# EAGLE design PST-10 (EAGLE 8.5.0)

## Sheet 1 of 2
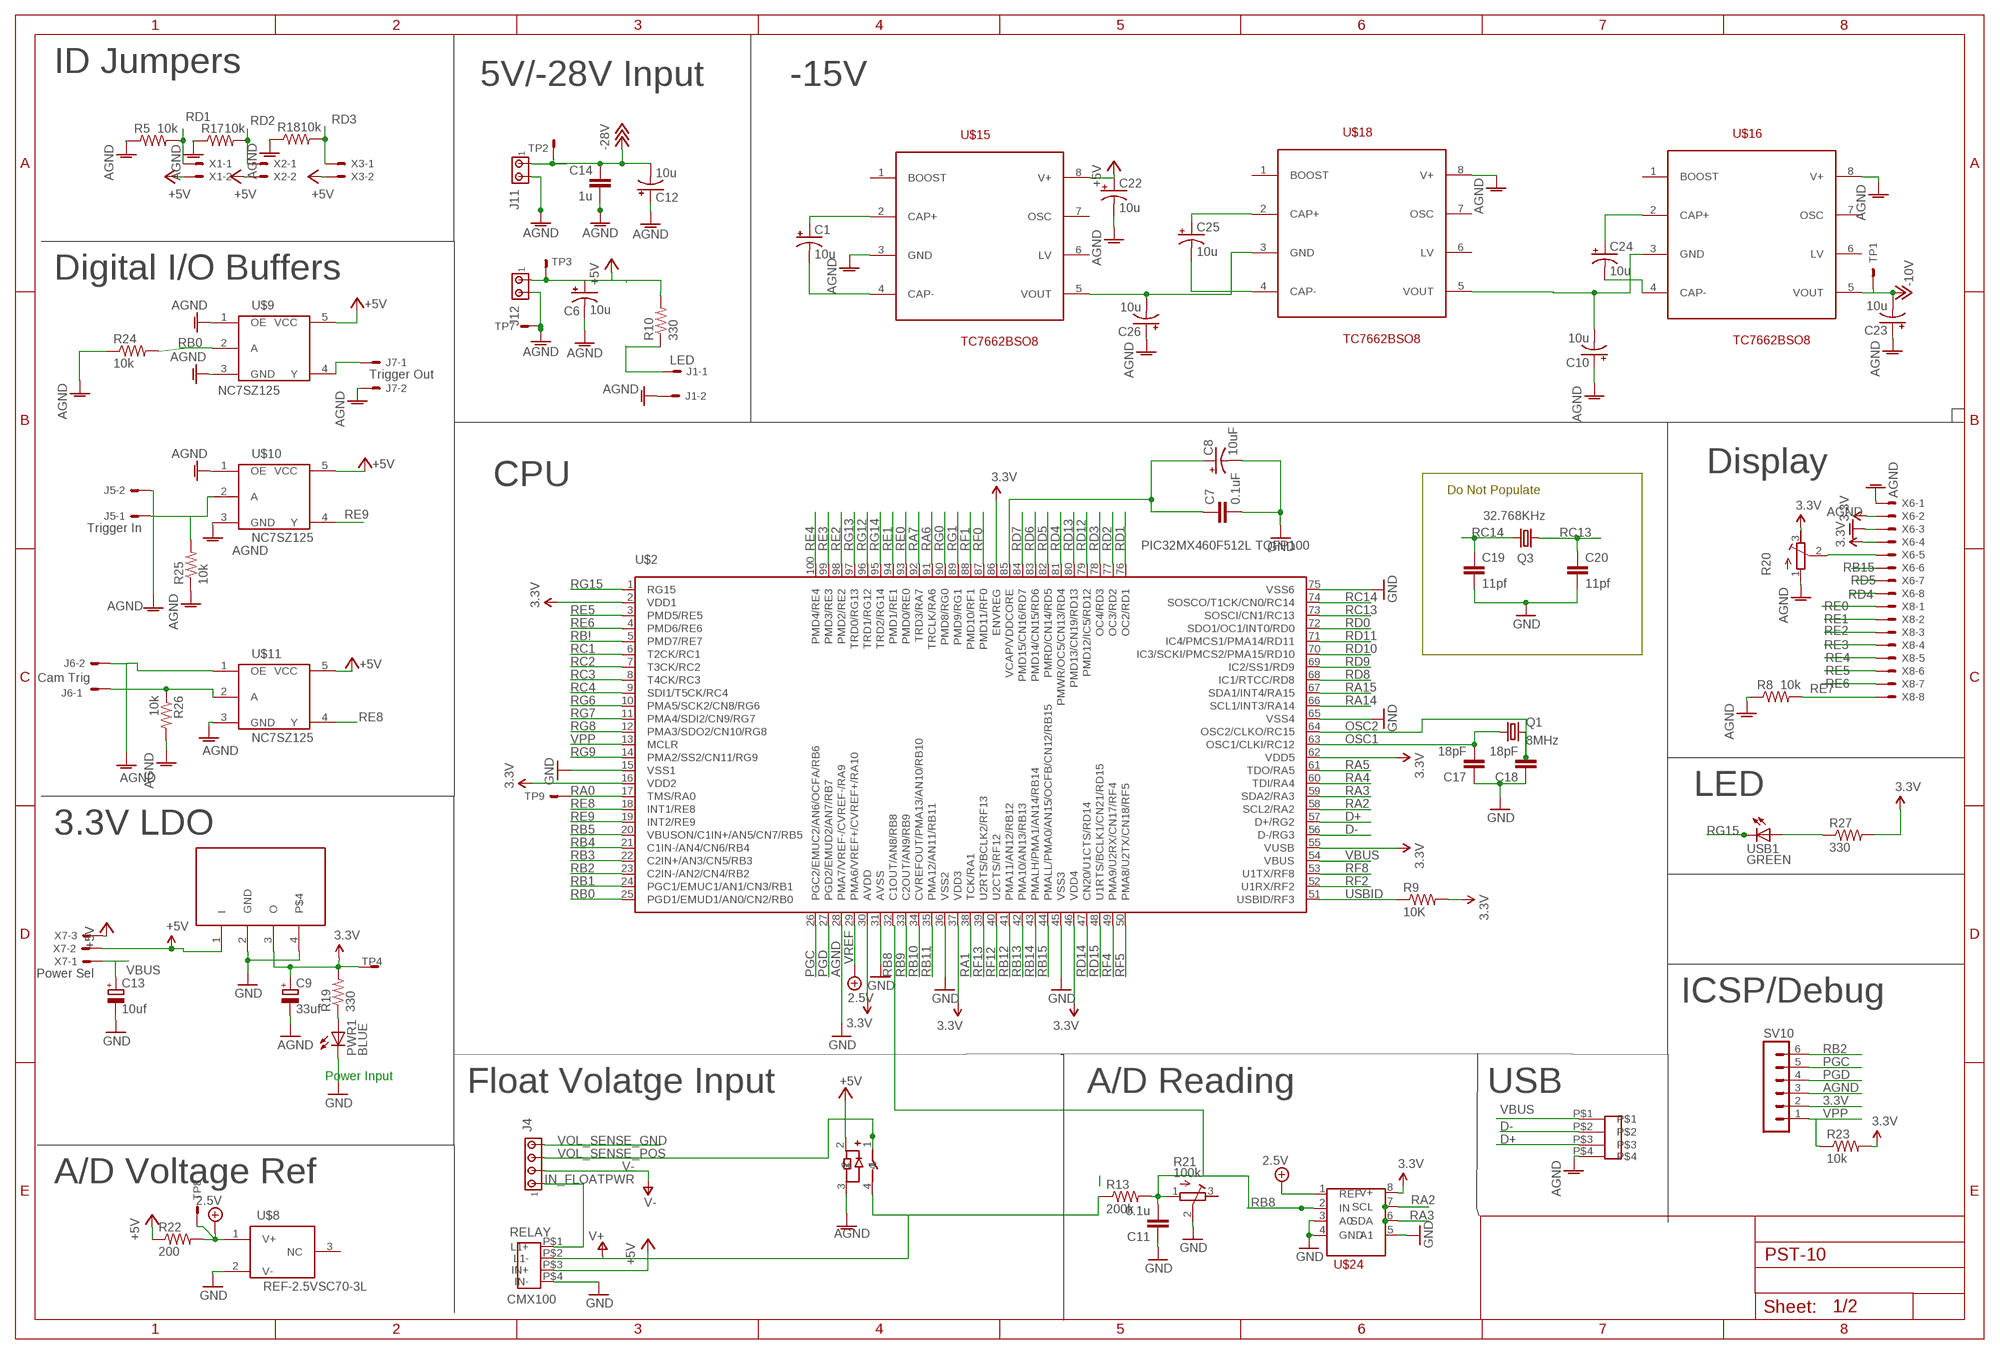
[diagram p0: schematic, sheet 1]

### Parts
C1  10u  CPOL-USE2-4  [E2-4]
C6  10u  CPOL-USE2-4  [E2-4]
C7  0.1uF  CAP0402-CAP  [0402-CAP]
C8  10uF  CAP_POL3528  [EIA3528]
C9  33uf  CPOL-EUE5-4  [E5-4]
C10  10u  CPOL-USE2-4  [E2-4]
C11  0.1u  C-EUC1206  [C1206]
C12  10u  CPOL-USE2-4  [E2-4]
C13  10uf  CPOL-EUE5-4  [E5-4]
C14  1u  C-EU025-024X044  [C025-024X044]
C17  18pF  CAP0402-CAP  [0402-CAP]
C18  18pF  CAP0402-CAP  [0402-CAP]
C19  11pf  CAP0402-CAP  [0402-CAP]
C20  11pf  CAP0402-CAP  [0402-CAP]
C22  10u  CPOL-USE2-4  [E2-4]
C23  10u  CPOL-USE2-4  [E2-4]
C24  10u  CPOL-USE2-4  [E2-4]
C25  10u  CPOL-USE2-4  [E2-4]
C26  10u  CPOL-USE2-4  [E2-4]
J1  LED  22-27-2021-02  [6410-02]
J4  MTA04-156  [1X4MTA]
J5  Trigger In  22-27-2021-02  [6410-02]
J6  Cam Trig  22-27-2021-02  [6410-02]
J7  Trigger Out  22-27-2021-02  [6410-02]
J11  MTA02-156  [1X2MTA]
J12  MTA02-156  [1X2MTA]
PWR1  BLUE  LED0603  [LED-0603]
Q1  8MHz  CRYSTAL5X3  [CRYSTAL-SMD-5X3]
Q3  32.768KHz  CRYSTAL32-SMD  [CRYSTAL-32KHZ-SMD]
R5  10k  R-US_R1206  [R1206]
R8  10k  R-US_R1206  [R1206]
R9  10K  RESISTOR0402-RES  [0402-RES]
R10  330  RESISTOR0402-RES  [0402-RES]
R13  200k  R-US_R1206  [R1206]
R17  10k  R-US_R1206  [R1206]
R18  10k  R-US_R1206  [R1206]
R19  330  RESISTOR0402-RES  [0402-RES]
R20  R-TRIMM3296W  [RTRIM3296W]
R21  100k  R-TRIMM3296W  [RTRIM3296W]
R22  200  R-US_R1206  [R1206]
R23  10k  R-US_R1206  [R1206]
R24  10k  R-US_R1206  [R1206]
R25  10k  R-US_R1206  [R1206]
R26  10k  R-US_R1206  [R1206]
R27  330  RESISTOR0402-RES  [0402-RES]
RELAY  CMX100  [CMX100D10]
SV10  MA06-1  [MA06-1]
TP1  TESTPOINT  [TESTPOINT]
TP2  TESTPOINT  [TESTPOINT]
TP3  TESTPOINT  [TESTPOINT]
TP4  TESTPOINT  [TESTPOINT]
TP7  TESTPOINT  [TESTPOINT]
TP8  TESTPOINT  [TESTPOINT]
TP9  TESTPOINT  [TESTPOINT]
U$2  PIC32MX460F512L TQFP100  PIC32MX4XXLTQFP100  [TQFP100]
U$7  3.3VREG  [SOT223]
U$8  REF-2.5VSC70-3L  [SC70-3L]
U$9  NC7SZ125  NC7SZ125SC70-5  [SC70-5]
U$10  NC7SZ125  NC7SZ125SC70-5  [SC70-5]
U$11  NC7SZ125  NC7SZ125SC70-5  [SC70-5]
U$15  TC7662BSO8  [SO8]
U$16  TC7662BSO8  [SO8]
U$18  TC7662BSO8  [SO8]
U$22  9007-05-01  [9007-05-01]
U$24  ADS7823MOSOP-08  [MSOP08]
USB  USB-B1KSW6  [USBB1K-4-VER]
USB1  GREEN  LED0603  [LED-0603]
X1  22-23-2021  [22-23-2021]
X2  22-23-2021  [22-23-2021]
X3  22-23-2021  [22-23-2021]
X6  22-23-2081  [22-23-2081]
X7  Power Sel  22-23-2031  [22-23-2031]
X8  22-23-2081  [22-23-2081]

### Nets
3.3V: C9.+ R9.2 R19.2 R20.3(A) R23.2 R27.2 SV10.2 TP4.TP(S) U$2.2(VDD1) U$2.16(VDD2) U$2.30(AVDD) U$2.37(VDD3) U$2.46(VDD4) U$2.55(VUSB) U$2.62(VDD5) U$2.86(ENVREG) U$7.3(O) U$24.8(V+) X6.2 X6.4
5V: U$7.1(I) X7.2 ; supply symbol labelled +5V
+5V: C6.+ C22.+ J12.1 R10.2 R22.1 RELAY.P$3(IN+) TP3.TP(S) U$9.5(VCC) U$10.5(VCC) U$11.5(VCC) U$15.8(V+) U$22.2 X1.2 X2.2 X3.2 X7.3 ; also sheet 2
-10V: C23.- TP1.TP(S) U$16.5(VOUT) ; also sheet 2
-18V: C12.- C14.1 J11.1 TP2.TP(S) ; supply symbol labelled -28V ; also sheet 2
AGND: C6.- C7.2 C8.C(-) C9.- C10.+ C11.1 C12.+ C13.- C14.2 C17.1 C18.1 C19.2 C20.2 C22.- C23.+ C26.+ J1.2 J5.2 J6.2 J7.2 J11.2 J12.2 PWR1.C R5.1 R8.1 R17.1 R18.1 R20.1(E) R21.2(S) R24.1 R25.1 R26.2 RELAY.P$4(IN-) SV10.3 TP7.TP(S) U$2.15(VSS1) U$2.28(PMA7/VREF-/CVREF-/RA9) U$2.31(AVSS) U$2.36(VSS2) U$2.45(VSS3) U$2.65(VSS4) U$2.75(VSS6) U$7.2(GND) U$7.4 U$8.2(V-) U$9.1(OE) U$9.3(GND) U$10.1(OE) U$10.3(GND) U$11.1(OE) U$11.3(GND) U$15.3(GND) U$16.8(V+) U$18.8(V+) U$22.3 U$24.3(A0) U$24.4(GND) U$24.5(A1) USB.P$4 X6.1 X6.3 ; supply symbol labelled GND ; also sheet 2
D+: U$2.57(D+/RG2) USB.P$3
D-: U$2.56(D-/RG3) USB.P$2
IN_FLOATPWR: J4.1 RELAY.P$1(L1+)
N$4: J6.1 R26.1 U$11.2(A)
N$6: R20.2(S) X6.5
N$10: C1.+ U$15.2(CAP+)
N$11: J1.1 R10.1
N$15: PWR1.A R19.1
N$16: J7.1 U$9.4(Y)
N$17: C1.- U$15.4(CAP-)
N$18: J5.1 R25.2 U$10.2(A)
N$22: C25.+ U$18.2(CAP+)
N$23: C10.- U$16.3(GND) U$18.5(VOUT)
N$25: C25.- U$18.4(CAP-)
N$26: C24.+ U$16.2(CAP+)
N$27: R27.1 USB1.A
N$28: C24.- U$16.4(CAP-)
N$33: C26.- U$15.5(VOUT) U$18.3(GND)
N$110: C7.1 C8.A(+) U$2.85(VCAP/VDDCORE)
OSC1: C17.2 Q1.1 U$2.63(OSC1/CLKI/RC12)
OSC2: C18.2 Q1.3 U$2.64(OSC2/CLKO/RC15)
PGC: SV10.5 U$2.26(PGC2/EMUC2/AN6/OCFA/RB6)
PGD: SV10.4 U$2.27(PGD2/EMUD2/AN7/RB7)
RA0: TP9.TP(S) U$2.17(TMS/RA0)
RA1: U$2.38(TCK/RA1)
RA2: U$2.58(SCL2/RA2) U$24.7(SCL)
RA3: U$2.59(SDA2/RA3) U$24.6(SDA)
RA4: U$2.60(TDI/RA4)
RA5: U$2.61(TDO/RA5)
RA6: U$2.91(TRCLK/RA6)
RA7: U$2.92(TRD3/RA7)
RA14: U$2.66(SCL1/INT3/RA14)
RA15: U$2.67(SDA1/INT4/RA15)
RB0: R24.2 U$2.25(PGD1/EMUD1/AN0/CN2/RB0) U$9.2(A)
RB1: U$2.24(PGC1/EMUC1/AN1/CN3/RB1)
RB2: SV10.6 U$2.23(C2IN-/AN2/CN4/RB2)
RB3: U$2.22(C2IN+/AN3/CN5/RB3)
RB4: U$2.21(C1IN-/AN4/CN6/RB4)
RB5: U$2.20(VBUSON/C1IN+/AN5/CN7/RB5)
RB8: C11.2 R13.2 R21.1(E) U$2.32(C1OUT/AN8/RB8) U$24.2(IN)
RB9: U$2.33(C2OUT/AN9/RB9)
RB10: U$2.34(CVREFOUT/PMA13/AN10/RB10)
RB11: U$2.35(PMA12/AN11/RB11)
RB12: U$2.41(PMA11/AN12/RB12)
RB13: U$2.42(PMA10/AN13/RB13)
RB14: U$2.43(PMALH/PMA1/AN14/RB14)
RB15: U$2.44(PMALL/PMA0/AN15/OCFB/CN12/RB15) X6.6
RB!: U$2.5(PMD7/RE7)
RC1: U$2.6(T2CK/RC1) ; also sheet 2
RC2: U$2.7(T3CK/RC2)
RC3: U$2.8(T4CK/RC3)
RC4: U$2.9(SDI1/T5CK/RC4)
RC13: C20.1 Q3.X1 U$2.73(SOSCI/CN1/RC13)
RC14: C19.1 Q3.X2 U$2.74(SOSCO/T1CK/CN0/RC14)
RD0: U$2.72(SDO1/OC1/INT0/RD0)
RD1: R5.2 U$2.76(OC2/RD1) X1.1
RD2: R17.2 U$2.77(OC3/RD2) X2.1
RD3: R18.2 U$2.78(OC4/RD3) X3.1
RD4: U$2.81(PMWR/OC5/CN13/RD4) X6.8
RD5: U$2.82(PMRD/CN14/RD5) X6.7
RD6: U$2.83(PMD14/CN15/RD6)
RD7: U$2.84(PMD15/CN16/RD7)
RD8: U$2.68(IC1/RTCC/RD8)
RD9: U$2.69(IC2/SS1/RD9)
RD10: U$2.70(IC3/SCKI/PMCS2/PMA15/RD10)
RD11: U$2.71(IC4/PMCS1/PMA14/RD11)
RD12: U$2.79(PMD12/IC5/RD12)
RD13: U$2.80(PMD13/CN19/RD13)
RD14: U$2.47(CN20/U1CTS/RD14)
RD15: U$2.48(U1RTS/BCLK1/CN21/RD15)
RE0: U$2.93(PMD0/RE0) X8.1
RE1: U$2.94(PMD1/RE1) X8.2
RE2: U$2.98(PMD2/RE2) X8.3
RE3: U$2.99(PMD3/RE3) X8.4
RE4: U$2.100(PMD4/RE4) X8.5
RE5: U$2.3(PMD5/RE5) X8.6
RE6: U$2.4(PMD6/RE6) X8.7
RE7: R8.2 X8.8
RE8: U$2.18(INT1/RE8) U$11.4(Y)
RE9: U$2.19(INT2/RE9) U$10.4(Y)
RF0: U$2.87(PMD11/RF0)
RF1: U$2.88(PMD10/RF1)
RF2: U$2.52(U1RX/RF2)
RF4: U$2.49(PMA9/U2RX/CN17/RF4)
RF5: U$2.50(PMA8/U2TX/CN18/RF5)
RF8: U$2.53(U1TX/RF8)
RF12: U$2.40(U2CTS/RF12)
RF13: U$2.39(U2RTS/BCLK2/RF13)
RG0: U$2.90(PMD8/RG0)
RG1: U$2.89(PMD9/RG1)
RG6: U$2.10(PMA5/SCK2/CN8/RG6)
RG7: U$2.11(PMA4/SDI2/CN9/RG7)
RG8: U$2.12(PMA3/SDO2/CN10/RG8)
RG9: U$2.14(PMA2/SS2/CN11/RG9)
RG12: U$2.96(TRD1/RG12)
RG13: U$2.97(TRD0/RG13)
RG14: U$2.95(TRD2/RG14)
RG15: U$2.1(RG15) USB1.C
USBID: R9.1 U$2.51(USBID/RF3)
V+: R13.1 RELAY.P$2(L1-) U$22.4 ; also sheet 2
V-: J4.2 ; also sheet 2
VBUS: C13.+ U$2.54(VBUS) USB.P$1 X7.1
VOL_SENSE_GND: J4.4 ; also sheet 2
VOL_SENSE_POS: J4.3 U$22.1
VPP: R23.1 SV10.1 U$2.13(MCLR)
VREF: R22.2 TP8.TP(S) U$2.29(PMA6/VREF+/CVREF+/RA10) U$8.1(V+) U$24.1(REF) ; supply symbol labelled 2.5V
Unconnected: R21.3(A) U$8.3(NC) U$15.1(BOOST) U$15.6(LV) U$15.7(OSC) U$16.1(BOOST) U$16.6(LV) U$16.7(OSC) U$18.1(BOOST) U$18.6(LV) U$18.7(OSC)

### Notes on the sheet
- ID Jumpers
- 5V/-28V Input | -15V
- Digital I/O Buffers
- Display
- CPU
- Do Not Populate
- LED
- 3.3V LDO
- ICSP/Debug
- Power Input
- Float Volatge Input | A/D Reading | USB
- A/D Voltage Ref

## Sheet 2 of 2
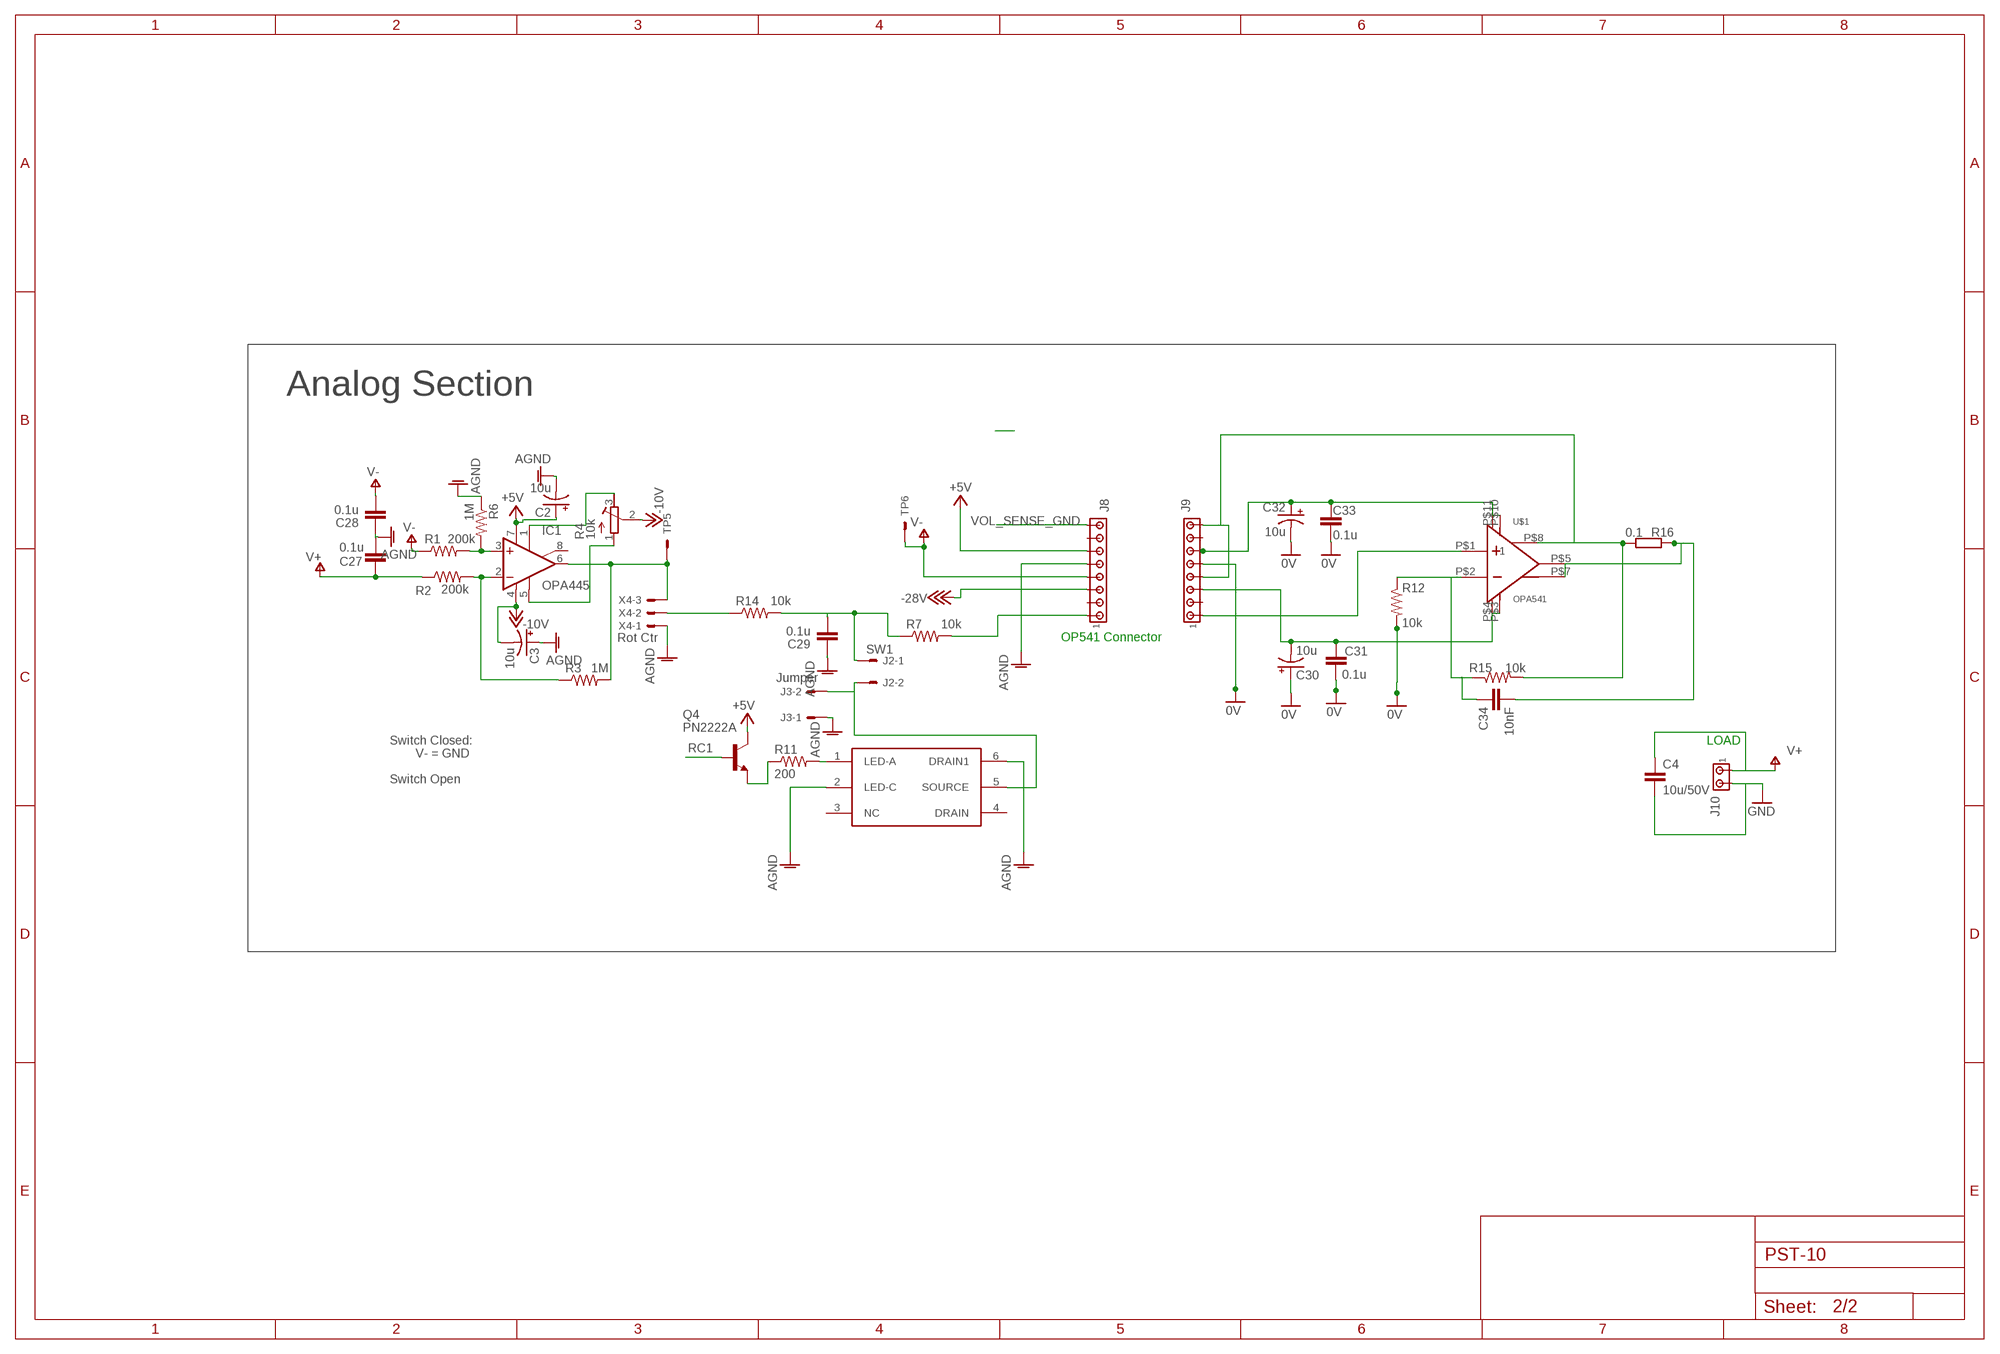
[diagram p1: schematic, sheet 2]

### Parts
C2  10u  CPOL-USE2-4  [E2-4]
C3  10u  CPOL-USE2-4  [E2-4]
C4  10u/50V  C-EUC1206  [C1206]
C27  0.1u  C-EUC1206  [C1206]
C28  0.1u  C-EUC1206  [C1206]
C29  0.1u  C-EUC1206  [C1206]
C30  10u  CPOL-USE2-4  [E2-4]
C31  0.1u  C-EU025-024X044  [C025-024X044]
C32  10u  CPOL-USE2-4  [E2-4]
C33  0.1u  C-EU025-024X044  [C025-024X044]
C34  10nF  C-EUC1206  [C1206]
IC1  OPA445  OP27Z  [DIL08]
J2  SW1  22-27-2021-02  [6410-02]
J3  Jumper  22-27-2021-02  [6410-02]
J8  MTA08-156  [1X8MTA]
J9  MTA08-156  [1X8MTA]
J10  MTA02-156  [1X2MTA]
Q4  PN2222A  [TO92-]
R1  200k  R-US_R1206  [R1206]
R2  200k  R-US_R1206  [R1206]
R3  1M  R-US_R1206  [R1206]
R4  10k  R-TRIMM3296W  [RTRIM3296W]
R6  1M  R-US_R1206  [R1206]
R7  10k  R-US_R1206  [R1206]
R11  200  R-US_R1206  [R1206]
R12  10k  R-US_R1206  [R1206]
R14  10k  R-US_R1206  [R1206]
R15  10k  R-US_R1206  [R1206]
R16  0.1  R-EU_V235/17  [V235/17]
TP5  TESTPOINT  [TESTPOINT]
TP6  TESTPOINT  [TESTPOINT]
U$1  OPA541  [OPA541]
U$4  PS7113DIL06  [DIL06]
X4  Rot Ctr  22-23-2031  [22-23-2031]

### Nets
0V: C30.+ C31.2 C32.- C33.1 J9.5 R12.2
+5V: C2.+ IC1.7(V+) J8.6 Q4.3(C) ; also sheet 1
-10V: C3.- IC1.4(V-) R4.2(S) ; also sheet 1
-18V: J8.3 ; supply symbol labelled -28V ; also sheet 1
AGND: C2.- C3.+ C4.2 C27.2 C28.1 C29.1 J3.1 J8.5 J10.2 R6.1 U$4.2(LED-C) U$4.6(DRAIN1) X4.1 ; supply symbol labelled GND ; also sheet 1
N$1: IC1.3(+IN) R1.2 R6.2
N$2: IC1.1(ON1) R4.3(A)
N$3: J8.1 R7.2
N$5: J9.4 J9.8 R15.2 R16.1 U$1.P$8(CURRENT_SENSE)
N$7: IC1.6(OUT) R3.2 TP5.TP(S) X4.3
N$8: IC1.2(-IN) R2.2 R3.1
N$9: R14.1 X4.2
N$12: J2.2 J3.2 U$4.5(SOURCE)
N$20: R11.2 U$4.1(LED-A)
N$21: Q4.1(E) R11.1
N$29: C29.2 J2.1 R7.1 R14.2
N$30: C30.- C31.1 J9.3 U$1.P$3(-VS) U$1.P$4(-VS2)
N$35: IC1.5(OPT) R4.1(E)
N$36: C32.+ C33.2 J9.6 U$1.P$10(V+) U$1.P$11(+VS2)
N$37: J9.1 U$1.P$1
N$38: C34.2 R16.2 U$1.P$5(VOUT) U$1.P$7(VOUT_2)
N$39: C34.1 R12.1 R15.1 U$1.P$2(IN-)
RC1: Q4.2(B) ; also sheet 1
V+: C4.1 C27.1 J10.1 R2.1 ; also sheet 1
V-: C28.2 J8.4 R1.1 TP6.TP(S) ; also sheet 1
VOL_SENSE_GND: J8.8 ; also sheet 1
Unconnected: IC1.8(ON2) J8.2 J8.7 J9.2 J9.7 U$4.3(NC) U$4.4(DRAIN)

### Notes on the sheet
- Analog Section
- OP541 Connector
- Switch Closed: | LOAD
- V- = GND
- Switch Open

## Library data of the parts
C1-C3 C6 C10 C12 C22-C26 C30 C32 = resistor:CPOL-US: POLARIZED CAPACITOR, American symbol
C4 C11 C14 C27-C29 C31 C33 C34 = rcl:C-EU: CAPACITOR, European symbol
C7 C17-C20 = SparkFun:CAP: Capacitor Standard 0603 ceramic capacitor, and 0.1" leaded capacitor.
C8 = SparkFun02-20-08:CAP_POL: Capacitor Polarized These are standard SMD and PTH capacitors. Normally 10uF, 47uF, and 100uF in electrolytic and tantalum varieties. Always verify the external diameter of the through hole cap, it varies with capacity, voltage, and manufacturer. The EIA devices should be standard.
C9 C13 = resistor:CPOL-EU: POLARIZED CAPACITOR, European symbol
IC1 = linear:OP27: OP AMP
J1-J3 J5-J7 = con-molex:22-?-02: CONNECTOR wire to board 2.54 mm (.1 inch) pitch header
J4 = con-amp:MTA04-156: AMP connector
J8 J9 = con-amp:MTA08-156: AMP connector
J10-J12 = con-amp:MTA02-156: AMP connector
PWR1 USB1 = SparkFun:LED: LEDs Standard schematic elements and footprints for 5mm, 3mm, 1206, and 0603 sized LEDs. 5mm - Spark Fun Electronics SKU : COM-00529 (and others)
Q1 = SparkFun11_03_09:CRYSTAL: Crystals Various standard crystals. Proven footprints. Spark Fun Electronics SKU : COM-00534
Q3 = SchmalzHaus:CRYSTAL: Crystals Various standard crystals. Proven footprints. Spark Fun Electronics SKU : COM-00534
Q4 = OMX-PICA:PN2222A: NPN Transistor
R1-R3 R5-R8 R11-R15 R17 R18 R22-R26 = resistor:R-US_: RESISTOR, American symbol
R4 R20 R21 = rcl:R-TRIMM: Trimm resistor
R9 R10 R19 R27 = SparkFun:RESISTOR: Resistor Basic schematic elements and footprints for 0603, 1206, and PTH 1/10th watt (small) resistors.
R16 = rcl:R-EU_: RESISTOR, European symbol
RELAY = OMX-MIX:CMX100
SV10 = con-lstb:MA06-1: PIN HEADER
TP1-TP9 = OMX-MIX:TESTPOINT
U$1 = Anthony-Relay:OPA541
U$2 = SchmalzHaus:PIC32MX4XXL
U$4 = OMX-MIX:PS7113
U$7 = SparkFun:3.3VREG
U$8 = OMX-MIX:REF-2.5V
U$9-U$11 = OMX-MIX:NC7SZ125
U$15 U$16 U$18 = OMX-MIX:TC7662B
U$22 = OMX-MIX:9007-05-01
U$24 = OMX-MIX:ADS7823
USB = OMX-MIX:USB-B1KSW6
X1-X3 = con-molex:22-23-2021: .100" (2.54mm) Center Header - 2 Pin
X4 X7 = con-molex:22-23-2031: .100" (2.54mm) Center Header - 3 Pin
X6 X8 = con-molex:22-23-2081: .100" (2.54mm) Center Header - 8 Pin

## Board
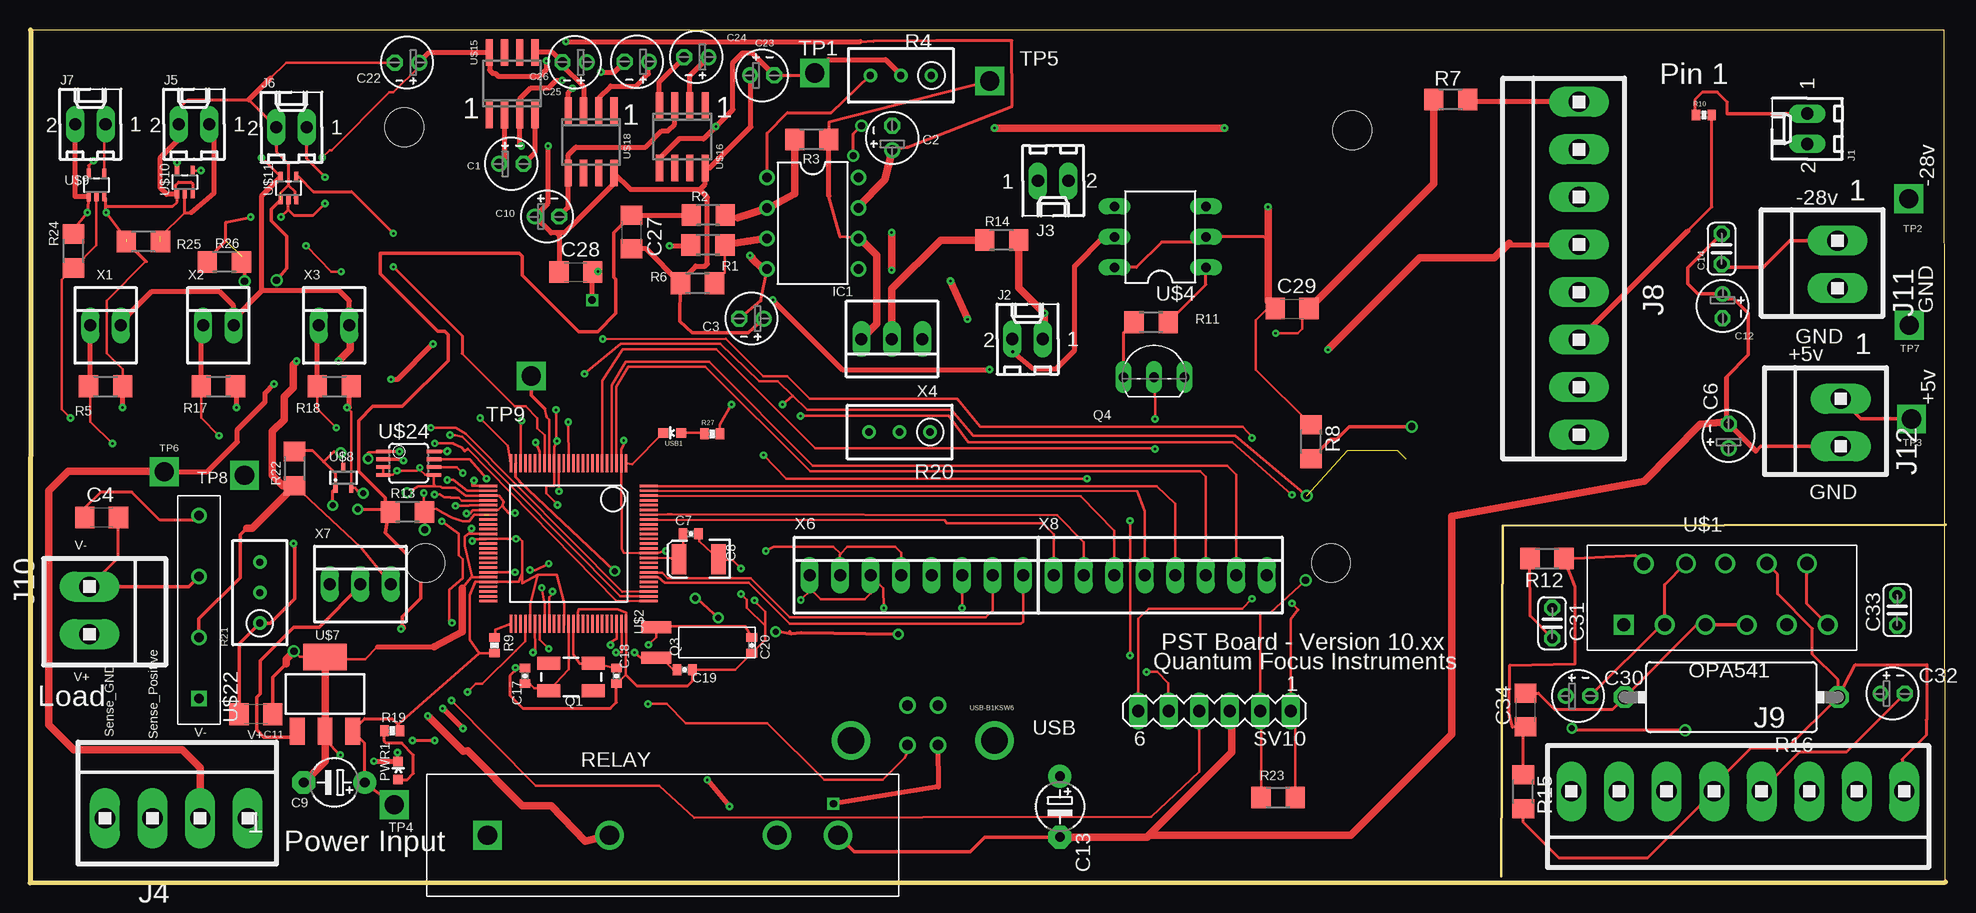
[diagram p2: board, top side]
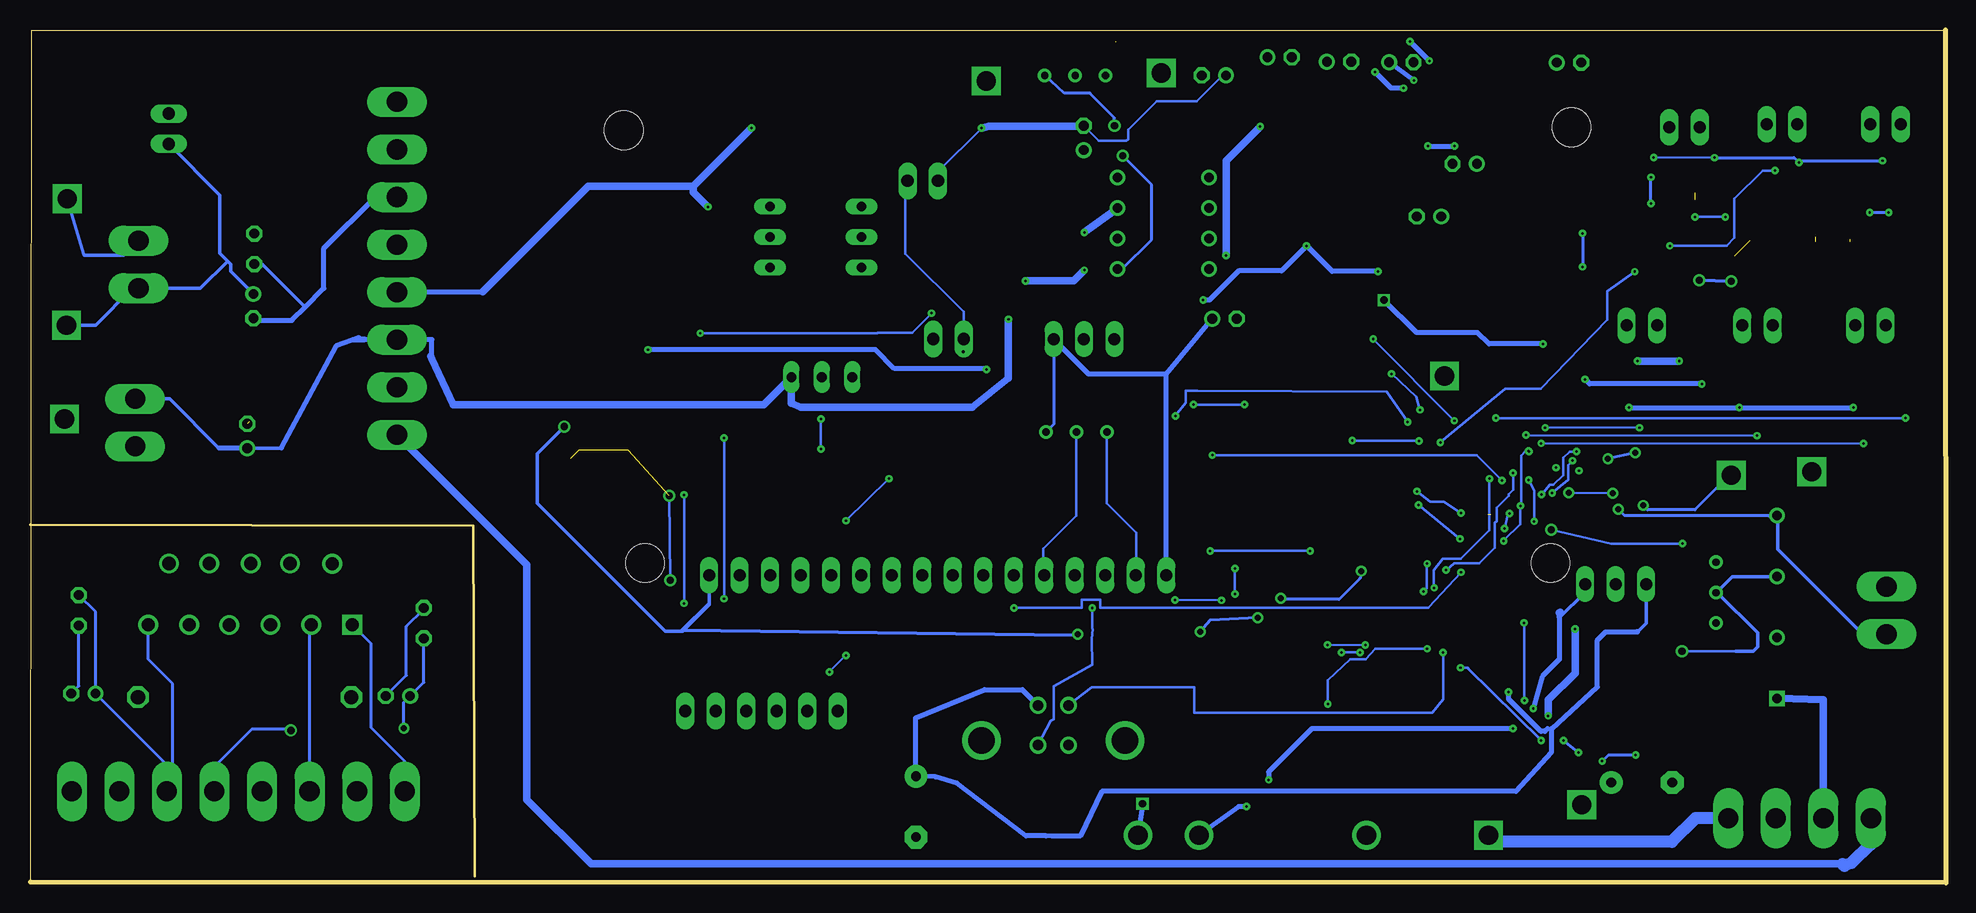
[diagram p3: board, bottom side, seen from below]

Size 159.66 x 71.07 mm. Coordinates in mm from the lower left corner, seen from the top.
Outline: 159.66,29.82 122.73,29.77 122.61,0.56
Outline: 0,0 159.62,0.05 159.52,71.04 0.05,71.07 0,0
Copper layers (1*16): Top 0.035mm / dielectric 1.5mm / Bottom 0.035mm
Design rules "default *": minimum track width 7mil, minimum drill 6mil, track to track 6mil, track to pad 6mil, pad to pad 6mil, via to via 6mil, smd to smd 6mil, copper to edge 20mil, drill to drill 6mil, minimum pad ring 10mil, minimum via ring 8mil, stop-mask expansion 4mil, vias tented up to drill 0mil, thermal gap 8mil
Holes 3.2 mm at 110.19,62.71 108.41,26.64 31.19,62.97 32.97,26.64

### Footprints (pad centres in the part's own frame; a part is rotated, then mirrored left to right if it is on the bottom)
E2-4 = drill 0.813 pad 1.27: + -1.016,0 | drill 0.813 pad 1.27 octagon: - 1.016,0
C1206 = smd 1.6 x 1.8: 1 -1.4,0; 2 1.4,0
0402-CAP = smd 0.7 x 0.9: 1 -0.65,0; 2 0.65,0
EIA3528 = smd 1.2 x 2.5: A 1.65,0; C -1.65,0
E5-4 = drill 0.813 pad 1.905: + -2.54,0 | drill 0.813 pad 1.905 octagon: - 2.54,0
C025-024X044 = drill 0.813 octagon: 1 -1.27,0; 2 1.27,0
DIL08 = drill 0.813 pad 1.27: 1 -3.81,-3.81; 2 -1.27,-3.81; 3 1.27,-3.81; 4 3.81,-3.81; 5 3.81,3.81; 6 1.27,3.81; 7 -1.27,3.81; 8 -3.81,3.81
6410-02 = drill 1.016 long: 1 1.27,0; 2 -1.27,0
1X4MTA = drill 1.676 long: 1 5.944,0; 2 1.981,0; 3 -1.981,0; 4 -5.944,0
1X8MTA = drill 1.676 long: 1 13.868,0; 2 9.906,0; 3 5.944,0; 4 1.981,0; 5 -1.981,0; 6 -5.944,0; 7 -9.906,0; 8 -13.868,0
1X2MTA = drill 1.676 long: 1 1.981,0; 2 -1.981,0
LED-0603 = smd 0.8 x 0.8: A 0,-0.75; C 0,0.75
CRYSTAL-SMD-5X3 = smd 1.9 x 1.1: 1 -1.85,-1.15; 2 1.85,-1.15; 3 1.85,1.15; 4 -1.85,1.15
CRYSTAL-32KHZ-SMD = smd 1 x 2.5: X1 -1.27,0; X2 1.27,0
TO92- = drill 0.813 long: 1 -2.54,0; 2 0,0; 3 2.54,0
R1206 = smd 1.6 x 1.803: 1 -1.422,0; 2 1.422,0
RTRIM3296W = drill 0.61: 1 0,-2.54; 2 0,0; 3 0,2.54
0402-RES = smd 0.7 x 0.9: 1 -0.65,0; 2 0.65,0
V235/17 = drill 1.194 octagon: 1 -8.89,0; 2 8.89,0
CMX100D10 = drill 1.6 square: P$1 -13.97,0 | drill 1.6: P$2 -3.81,0; P$3 10.16,0; P$4 15.24,0
MA06-1 = drill 1.016 long: 1 -6.35,0; 2 -3.81,0; 3 -1.27,0; 4 1.27,0; 5 3.81,0; 6 6.35,0
TESTPOINT = drill 1.6 square: TP 0,0
OPA541 = drill 1.1 square: P$1 -8.89,-2.54 | drill 1.1: P$2 -7.239,2.54; P$3 -5.486,-2.54; P$4 -3.708,2.565; P$5 -2.083,-2.54; P$6 -0.432,2.565; P$7 1.346,-2.565; P$8 3.023,2.565; P$9 4.699,-2.54; P$10 6.375,2.565; P$11 8.103,-2.54
TQFP100 = smd 0.2 x 1.5: 1 -4.8,-6.7; 2 -4.4,-6.7; 3 -4,-6.7; 4 -3.6,-6.7; 5 -3.2,-6.7; 6 -2.8,-6.7; 7 -2.4,-6.7; 8 -2,-6.7; 9 -1.6,-6.7; 10 -1.2,-6.7; 11 -0.8,-6.7; 12 -0.4,-6.7; 13 0,-6.7; 14 0.4,-6.7; 15 0.8,-6.7; 16 1.2,-6.7; 17 1.6,-6.7; 18 2,-6.7; 19 2.4,-6.7; 20 2.8,-6.7; 21 3.2,-6.7; 22 3.6,-6.7; 23 4,-6.7; 24 4.4,-6.7; 25 4.8,-6.7; 51 4.8,6.7; 52 4.4,6.7; 53 4,6.7; 54 3.6,6.7; 55 3.2,6.7; 56 2.8,6.7; 57 2.4,6.7; 58 2,6.7; 59 1.6,6.7; 60 1.2,6.7; 61 0.8,6.7; 62 0.4,6.7; 63 0,6.7; 64 -0.4,6.7; 65 -0.8,6.7; 66 -1.2,6.7; 67 -1.6,6.7; 68 -2,6.7; 69 -2.4,6.7; 70 -2.8,6.7; 71 -3.2,6.7; 72 -3.6,6.7; 73 -4,6.7; 74 -4.4,6.7; 75 -4.8,6.7 | smd 1.5 x 0.2: 26 6.7,-4.8; 27 6.7,-4.4; 28 6.7,-4; 29 6.7,-3.6; 30 6.7,-3.2; 31 6.7,-2.8; 32 6.7,-2.4; 33 6.7,-2; 34 6.7,-1.6; 35 6.7,-1.2; 36 6.7,-0.8; 37 6.7,-0.4; 38 6.7,0; 39 6.7,0.4; 40 6.7,0.8; 41 6.7,1.2; 42 6.7,1.6; 43 6.7,2; 44 6.7,2.4; 45 6.7,2.8; 46 6.7,3.2; 47 6.7,3.6; 48 6.7,4; 49 6.7,4.4; 50 6.7,4.8; 76 -6.7,4.8; 77 -6.7,4.4; 78 -6.7,4; 79 -6.7,3.6; 80 -6.7,3.2; 81 -6.7,2.8; 82 -6.7,2.4; 83 -6.7,2; 84 -6.7,1.6; 85 -6.7,1.2; 86 -6.7,0.8; 87 -6.7,0.4; 88 -6.7,0; 89 -6.7,-0.4; 90 -6.7,-0.8; 91 -6.7,-1.2; 92 -6.7,-1.6; 93 -6.7,-2; 94 -6.7,-2.4; 95 -6.7,-2.8; 96 -6.7,-3.2; 97 -6.7,-3.6; 98 -6.7,-4; 99 -6.7,-4.4; 100 -6.7,-4.8
DIL06 = drill 0.813 long: 1 -2.54,-3.81; 2 0,-3.81; 3 2.54,-3.81; 4 2.54,3.81; 5 0,3.81; 6 -2.54,3.81
SOT223 = smd 1.219 x 2.235: 1 -2.311,-3.099; 2 0,-3.099; 3 2.311,-3.099 | smd 3.6 x 2.2: 4 0,3.099
SC70-3L = smd 0.35 x 0.8: 1 -0.65,-0.85; 2 0.65,-0.85; 3 0,0.85
SC70-5 = smd 0.35 x 0.8: 1 -0.65,-0.95; 2 0,-0.95; 3 0.65,-0.95; 4 0.65,0.95; 5 -0.65,0.95
SO8 = smd 0.6 x 2.2: 1 -1.905,-2.6; 2 -0.635,-2.6; 3 0.635,-2.6; 4 1.905,-2.6; 5 1.905,2.6; 6 0.635,2.6; 7 -0.635,2.6; 8 -1.905,2.6
9007-05-01 = drill 0.8 square: 1 -5.08,0 | drill 0.8: 2 0,0; 3 5.08,0; 4 10.16,0
MSOP08 = smd 0.3 x 1.2: 1 -0.976,-2.113; 2 -0.326,-2.113; 3 0.324,-2.113; 4 0.974,-2.113; 5 0.974,2.112; 6 0.324,2.112; 7 -0.326,2.112; 8 -0.976,2.112
USBB1K-4-VER = drill 0.9: P$1 1.27,1.651; P$2 -1.27,1.651; P$3 -1.27,-1.651; P$4 1.27,-1.651 | drill 2.2: P$5 -5.969,-1.27; P$6 5.969,-1.27
22-23-2021 = drill 1 long: 1 -1.27,0; 2 1.27,0
22-23-2031 = drill 1 long: 1 -2.54,0; 2 0,0; 3 2.54,0
22-23-2081 = drill 1 long: 1 -8.89,0; 2 -6.35,0; 3 -3.81,0; 4 -1.27,0; 5 1.27,0; 6 3.81,0; 7 6.35,0; 8 8.89,0

### Placement (x,y rotation side)
C1  40.11,59.92 0 top
C2  71.86,62.08 90 top
C3  60.12,47.02 180 top
C4  5.97,30.45 0 top
C6  141.55,37.24 90 top
C7  55.07,29.08 0 top
C8  55.73,26.97 180 top
C9  25.35,8.36 180 top
C10  43.08,55.52 0 top
C11  18.82,14.05 180 top
C12  141.05,48.06 270 top
C13  85.83,6.35 270 top
C14  140.97,52.83 90 top
C17  41.25,17.25 270 top
C18  48.87,17.25 90 top
C19  54.56,17.75 0 top
C20  60.15,19.79 270 top
C22  31.42,68.35 180 top
C23  61.01,67.28 0 top
C24  55.52,68.81 180 top
C25  50.57,68.43 180 top
C26  45.39,68.38 180 top
C27  50.11,54.23 270 top
C28  45.49,50.9 0 top
C29  105.18,47.85 0 top
C30  129.01,15.57 0 top
C31  126.85,21.64 270 top
C32  155.22,15.77 0 top
C33  155.6,22.71 90 top
C34  124.64,14.4 90 top
IC1  65.23,54.97 270 top
J1  148.11,62.84 90 top
J2  83.13,45.31 0 top
J3  85.27,58.5 180 top
J4  12.19,5.38 0 top
J5  13.67,63.22 0 top
J6  21.79,62.97 0 top
J7  5.03,63.22 0 top
J8  129.08,51.21 90 top
J9  142.32,7.62 180 top
J10  4.95,22.71 270 top
J11  150.62,51.54 90 top
J12  150.9,38.35 90 top
PWR1  30.68,9.37 0 top
Q1  45.09,17.14 0 top
Q3  52.17,20.04 270 top
Q4  93.68,42.14 0 top
R1  56.49,53.16 0 top
R2  56.52,55.65 0 top
R3  65.15,61.95 0 top
R4  72.57,67.28 90 top
R5  6.3,41.38 180 top
R6  55.63,49.96 0 top
R7  118.39,65.28 0 top
R8  106.76,36.75 270 top
R9  38.71,19.79 270 top
R10  139.5,63.98 0 top
R11  93.42,46.71 0 top
R12  126.42,27.03 180 top
R13  31.45,30.91 0 top
R14  80.98,53.57 0 top
R15  124.43,7.59 270 top
R16  141.78,15.47 180 top
R17  15.7,41.38 180 top
R18  25.35,41.38 180 top
R19  30.18,12.67 0 top
R20  72.47,37.57 90 top
R21  19.15,24.18 0 top
R22  22.05,34.52 90 top
R23  104.01,7.11 180 top
R24  3.63,52.65 270 top
R25  9.45,53.44 0 top
R26  16.21,51.74 0 top
R27  56.85,37.41 0 top
RELAY  52.1,3.96 0 top
SV10  98.7,14.33 180 top
TP1  65.41,67.49 0 top
TP2  156.57,57 0 top
TP3  156.79,38.66 0 top
TP4  30.35,6.5 0 top
TP5  79.98,66.83 0 top
TP6  11.18,34.26 0 top
TP7  156.62,46.46 0 top
TP8  17.88,33.96 0 top
TP9  41.78,42.24 0 top
U$1  141.71,24.05 0 top
U$2  44.88,28.27 180 top
U$4  94.18,53.82 90 top
U$7  24.59,15.72 0 top
U$8  26.11,33.76 0 top
U$9  5.54,58.14 0 top
U$10  12.9,58.39 0 top
U$11  21.54,57.89 0 top
U$15  40.18,66.6 0 top
U$16  54.36,62.18 180 top
U$18  46.76,61.75 180 top
U$22  14.07,20.45 90 top
U$24  31.55,34.98 270 top
USB  74.4,13.13 0 top
USB1  53.52,37.49 90 top
X1  6.3,46.46 0 top
X2  15.7,46.46 0 top
X3  25.35,46.46 0 top
X4  71.83,45.31 180 top
X6  73.86,25.63 0 top
X7  27.53,24.89 0 top
X8  94.18,25.63 0 top

### Tracks (layer width: path | path; a pad name or v marks a point on that pad's centre or on a via)
0V  (via drill 0.5, 0.6)
  Top 0.254: R12.2 125.02,22.25 C31.2 | J9.5 v144.3,7.72 147.5,10.92 151.38,10.92 C32.- | v137.92,12.7 128.68,12.7 v128.5,12.88
  Bottom 0.254: C31.2 126.85,16.71 C30.+ 128.5,15.06 v128.5,12.88 | C33.1 155.6,16.41 C32.- | v144.3,7.72 144.3,9.68 141.15,12.83 138.05,12.83 v137.92,12.7
3.3V  (via drill 0.2, 0.6)  (3 unrouted)
  Top 0.203: X6.4 72.59,27.51 72.11,27.99 68.12,27.99 67.55,27.42 | 67.55,27.42 67.49,27.36 67.49,25.65 X6.2 | 37.43,19.14 R9.2 | 37.43,19.14 36.65,20.27 36.63,23.98 37.11,25.07 38.13,25.07 U$2.46 40.74,25.1 41.02,25.81 | 41.02,25.81 41.02,28.45 40.79,28.68 37.99,28.65 | 37.99,28.65 U$2.37 v40.51,28.67 | v43.97,31.5 43.03,32.46 43.03,33.1 43.69,33.1 43.69,34.13 U$2.16 43.68,36.32 v43.92,36.83 43.84,37.16 v43.84,39.42 | v49.48,36.86 49.48,36.5 49.28,36.14 49.28,34.99 U$2.2 49.31,27.86 49.48,27.51 51.26,27.46 U$2.86 52.39,27.5 v52.98,27.66 | 30.68,13.18 30.68,13.23 37.43,19.14 | v61.32,27.66 61.98,28.02 66.95,28.02 67.55,27.42 | U$2.55 41.68,23.22 42.32,25.68 | 42.32,25.68 43.89,25.68 44.5,23.29 44.5,21.51 U$2.62 | 41.02,25.81 41.02,24.97 42.32,25.68 | R23.2 102.59,14.25 SV10.2 102.51,22.38 102.62,22.48 103.33,22.48 v106.3,25.22 | v106.4,32.26 100.43,37.26 78.59,37.26 76.76,39.42 64.77,39.42 63.56,40.59 | 63.56,40.59 62.33,41.78 60.78,41.78 57.51,44.93 49.23,44.93 v46.2,42.42 | R27.2 57.5,38.19 v58.45,39.85 | 63.56,40.59 v62.7,39.85 | U$24.8 v34.76,35.95 v34.8,35.99 | v35.46,31.42 36.58,31.42 36.63,31.47 U$2.30 | 37.99,28.65 36.98,28.65 v36.86,28.47
  Top 0.254: R19.2 30.68,12.82 30.68,13.18 30.18,13.69 27.89,13.69 26.9,12.7 U$7.3 27.89,11.63 C9.+ TP4.TP
  Top 0.305: 106.3,32.46 106.55,32.21 106.32,32.21 106.27,32.16 106.3,32.16 v106.4,32.26
  Bottom 0.203: R20.3 69.93,31.62 67.49,29.18 67.49,25.65 X6.2 | v40.51,28.67 v43.97,31.5 | v43.92,36.83 v49.48,36.86 | v52.98,27.66 v61.32,27.66 | v106.4,32.26 v106.3,25.22 | v43.84,39.42 44.15,40.51 v46.2,42.42 | v62.7,39.85 v58.45,39.85 | v34.76,35.95 35.07,35.95 35.41,35.61 35.41,31.47 v35.46,31.42 35.46,29.87 36.8,28.57 v36.86,28.47
5V
  Top 0.305: X7.2 27.53,24.74 24.1,21.31 22,21.31 19.18,18.49 19.18,15.77 18.9,15.47 18.9,12.75 19.48,12.14 21.79,12.14 U$7.1
+5V  (via drill 0.2)  (1 unrouted)
  Top 0.203: X7.3 27.56,27.97 R22.1 | C22.+ 32.44,68.02 30.28,65.86 29.95,65.86 25.15,61.06 24.97,61.06 v24.36,60.45 | v19.3,60.43 v19.27,60.43
  Top 0.254: v12.25,60.03 U$10.5 | U$11.5 v19.3,60.43 | U$9.5 4.89,59.78 v5.28,60.17 | 69.22,70.05 70.28,70.13 75.49,70.18 81.81,70.18 81.84,64.72 73.1,61.32 71.91,61.16 C2.+ 71.81,60.83 | IC1.7 68.96,56.31 | R10.2 140.15,56.33 138.15,54.33
  Top 0.305: TP3.TP 152.58,38.66 J12.1 | U$22.2 14.07,22 17.5,25.43 17.5,29.01 18.06,29.57
  Top 0.406: X1.2 7.57,46.71 10.11,49.25 15.8,49.25 16.97,48.08 16.97,46.96 | 16.97,46.96 X2.2 | X3.2 26.62,48.49 25.78,49.33 19.33,49.33 | 19.33,49.33 16.97,46.96 | 19.33,49.33 19.33,57.28 U$11.5 | C22.+ 33.28,69.2 U$15.8 38.3,69.17 38.3,67.72 38.56,67.46 38.79,67.46 39.01,67.23 42.47,67.23 43.05,67.82 v43.05,68.5 | v44.65,70.1 69.19,70.1 | v34.39,14.53 v36.09,12.85 | v56.44,8.59 v58.29,6.35 | J8.6 138.15,54.33
  Top 0.61: 68.96,56.31 71.25,58.6 71.81,60.83 | v78.13,46.96 v76.71,50.16 | v71.81,51.05 v71.81,54.2 | v22.23,43.48 21.92,43.18 21.92,41.25 21.18,40.51 21.18,38.61 20.19,37.62 20.19,33.99 21.08,33.1 R22.1 18.52,29.57 18.06,29.57 | v25.71,43.48 26.7,44.48 26.7,46.38 X3.2
  Bottom 0.203: v19.27,60.43 v24.36,60.45
  Bottom 0.254: v19.3,60.43 v19.27,60.43 12.65,60.43 v12.25,60.03 12.11,60.17 v5.28,60.17
  Bottom 0.305: C6.+ 138.74,36.22 138.71,36.25 | J12.1 148.03,40.34 143.92,36.22 | X7.3 30.07,24.21 32.21,22.07
  Bottom 0.406: v43.05,68.5 v44.65,70.1 | 32.21,22.5 32.21,22.07 32.21,18.62 33.63,17.2 v34.39,14.53 | v36.09,12.85 52.83,12.85 56.44,9.25 v56.44,8.59 | v58.29,6.35 58.95,6.35 RELAY.P$3 | 138.71,36.25 134.16,44.75 132.28,45.44 132.13,45.29 131.72,45.29 131.75,45.26 132.76,45.26 | 126.17,43.66 126.17,45.26 J8.6 132.76,45.26 | 132.76,45.26 132.76,45.27 | C6.+ 143.92,36.22
  Bottom 0.61: 126.26,43.87 126.17,43.66 124.38,39.83 98.53,39.83 Q4.3 96.22,39.98 95.45,39.62 81.13,39.62 78.13,42.06 v78.13,46.96 | v76.71,50.16 72.7,50.16 v71.81,51.05 | v71.81,54.2 IC1.7 | v22.23,43.48 v25.71,43.48 | 32.21,22.5 32.16,22.56
-10V  (via drill 0.2)
  Top 0.254: IC1.4 60.91,48.49 C3.- | C23.- 65.2,67.28 TP1.TP
  Top 0.406: U$16.5 52.45,60.35 54.1,62 56.13,62 v57.15,63.02 58.57,64.44 58.57,68.35 59.39,69.16 60.15,69.16 C23.- | R4.2 72.57,67.34 71.3,68.61 66.52,68.61 TP1.TP
  Top 0.61: IC1.4 61.06,51.16 60.2,52.02 60.2,52.07 v60,52.27
  Bottom 0.61: v60,52.27 60,60.17 v57.15,63.02
-18V
  Top 0.305: J11.1 146.66,53.52 144.45,51.31 141.22,51.31 C14.1
  Bottom 0.152: C12.- 140.87,46.86
  Bottom 0.254: 155.14,52.3 TP2.TP
  Bottom 0.305: 155.14,52.3 151.84,52.3 J11.1 | C14.1 140.31,51.56 136.73,47.98
  Bottom 0.406: J8.3 130.91,57.15 135.18,52.88 135.18,49.53 136.73,47.98 137.85,46.86 140.87,46.86
AGND  (via drill 0.2, 0.5, 0.6)  (3 unrouted)
  Top 0.203: 65.1,24.43 65.89,23.65 69.57,23.65 70.05,24.13 X6.3 71.12,24.56 v71.15,22.91 | 65.1,24.43 65.1,25.5 X6.1 | C7.2 55.77,28.48 C8.C 58.55,26.9 v59.26,26.19 | C18.1 49.66,17.33 49.68,20.85 49.71,21.11 U$2.75 49.71,21.62 49.71,22.5 49,22.81 45.72,22.81 45.66,22.52 U$2.65 | C19.2 58.77,17.75 C20.2 61.27,20.25 61.27,21.41 | v26.42,39.6 26.76,39.25 U$8.2 27.12,32.91 27.15,32.84 27.41,32.54 v27.76,32.46 | 39.37,31.42 39.5,31.78 39.1,32.27 U$2.28 37.84,32.26 36.3,32.26 35.42,32.91 34.35,32.91 34.24,33.02 33.78,33.03 | 39.37,31.42 39.04,31.09 37.93,31.06 | 37.93,31.06 U$2.31 | 36.6,29.08 36.47,29.03 36.22,28.83 36.22,28.09 36.8,25.63 36.89,25.47 U$2.45 36.77,25.47 36.02,24.54 | 36.6,29.08 37.89,29.08 U$2.36 | v59.26,24.08 59.74,23.6 59.74,22.94 61.27,21.41 | v36.37,30.78 36.68,30.78 36.88,31.06 37.93,31.06 | 36.6,29.08 v36.78,29.54 | v44.08,32.63 U$2.15 | v40.41,30.81 39.88,30.81 39.37,31.42 | 33.78,33.03 33.66,33.05 32.36,33.05 v31.42,32.51 | U$7.4 25.43,19.66 | R24.1 3.63,54.46 v4.78,55.85 | v6.35,55.85 8.03,53.62 | 9.73,51.74 9.67,51.8 6.38,48.51 6.38,44.15 7.72,42.8 R5.1 | 61.27,21.41 61.27,22.58 60.55,23.29 v60.38,23.55 | v64.24,23.57 65.1,24.43 | U$7.4 22.48,18.82 v22,19.3 | 28.96,19.66 27.94,18.64 24.77,18.64 U$7.4 | C22.- 21.34,68.35 20.04,67.06 | 103.18,48.46 C29.1 103.12,47.85 102.16,46.89 102.16,42.77 R8.1 | U$24.3 U$24.4 30.24,34 v30.58,34.34 32.23,34.34 v32.49,34.59 32.49,34.44 32.92,34.01 U$24.5 33.66,33.21 33.78,33.03
  Top 0.254: U$10.3 13.55,58.25 13.41,58.39 12.4,58.39 12.14,58.14 12.14,57.56 U$10.1 12.25,56.73 11.89,56.36 6.3,56.36 | 21.54,58.14 21.54,59.92 20.52,60.93 J6.2 18.24,65.25 13.16,65.25 12.4,64.49 J5.2 | 21.54,58.14 22.05,57.63 22.05,57.08 U$11.3 | U$9.1 4.86,55.95 v4.78,55.85 | v6.35,55.85 6.3,56.36 | 6.3,56.36 6.3,57.08 U$9.3 | 24.59,11.91 v25.86,10.64 | 30.67,10.13 PWR1.C 30.63,10.17 v30.63,10.87 | v40.46,17.92 40.89,17.93 C17.1 40.63,17.9 39.98,17.25 39.98,15.62 41.07,14.53 48.36,14.53 48.87,15.04 C18.1 | v31.88,11.86 v33.73,11.86 | C19.2 55.21,16.83 54.81,16.43 50.56,16.43 49.66,17.33 | 21.54,58.14 20.89,57.49 | U$4.6 92.2,51.28 94.31,53.39 97.56,53.39 U$4.2 102.82,53.82 103.18,53.47 | C4.2 7.37,27.1 J10.2
  Top 0.305: R6.1 54.15,46.79 55.19,45.85 59.87,45.85 C3.+ | C13.- 79.58,3.81 78.36,2.59 68.71,2.59 RELAY.P$4 | J12.2 144.25,36.37 143.84,35.97 | C14.2 138.13,51.26 138.13,49.91 138.96,49.07 C12.+ 141.45,48.67 141.99,48.67 143.21,47.45 143.21,44.02 141.38,42.19 141.38,42.09 | J10.2 13.23,24.69 U$22.3 | C11.1 20.22,17.12 21.34,18.24 | 9.67,51.8 R25.1 | U$11.1 20.09,56.13 20.09,55.19 21.41,53.87 21.41,51.21 v20.55,50.22 | v17.88,50.14 17.88,51.49 R26.2
  Top 0.406: U$9.1 3.76,57.19 J7.2 | J5.2 12.4,61.95 10.87,60.43 10.87,57.89 11.38,57.38 12.19,57.38 U$10.1 | R17.1 17.22,41.38 v17.22,39.6 | v7.72,39.6 R5.1 | R18.1 26.62,41.38 26.62,39.6 v26.42,39.6 | v28.65,10.13 30.67,10.13 | 18.24,65.25 20.04,67.06 | 28.96,19.66 33.71,19.66 | 55.8,57.76 56.26,58.22 U$16.8 56.66,59.58 60.07,62.99 60.07,67.21 C23.+ | 55.8,57.76 50.05,57.76 U$18.8 48.67,58.27 45.64,55.24 45.64,55.22 44.58,54.15 43.89,54.15 | 43.89,54.15 43.43,54.15 C10.+ 43.18,56.64 v43.18,61.39 | v40.95,61.39 40.82,61.52 U$15.3 40.82,65.33 41.73,66.24 43.23,66.24 43.87,66.88 v44.35,66.88 | 55.8,57.76 56.44,57.12 56.44,51.59 56.24,51.38 55.47,51.38 54.2,50.11 R6.1 51.34,52.83 C27.2 | C28.1 44.09,53.95 43.89,54.15 | v66.95,6.58 75.69,8 USB.P$4 | C6.- 143.84,35.97 | 141.38,38.43 141.38,42.09
  Top 0.61: v80.37,62.89 v99.54,62.89 | U$7.4 U$7.2 24.59,11.91 24.59,10.13 C9.- | 36.02,24.54 36.02,20.9 33.71,19.66 | v103.18,56.34 103.18,53.8 | 21.34,18.24 21.34,18.64 v22,19.3 | C13.- 93.09,3.81 93.24,3.96 | 93.24,3.96 100.15,10.87 100.15,14.15 SV10.3 | 93.24,3.96 110.06,3.96 118.47,12.37 118.47,30.53 134.52,33.45 139.19,38.2 141.38,38.43 | 103.18,53.8 103.18,53.47 103.18,48.46 | 103.18,53.8 103.15,53.82
  Bottom 0.203: v59.26,24.08 v59.26,26.19 | v36.37,30.78 36.53,30.66 v36.78,29.54 | v44.08,32.63 42.98,31.75 41.83,31.75 v40.41,30.81 | v31.42,32.51 v27.76,32.46 | v60.38,23.55 v64.24,23.57 | USB.P$4 74.6,13.49 74.37,13.61 74.37,16.38 71.15,18.19 71.17,20.32 71.12,21.13 71.15,21.23 v71.15,22.91 | 17.5,19.3 v22,19.3 | J3.1 84,59.26 v80.37,62.89 | C23.+ 60.27,67.28 62.43,65.13 65.79,65.13 68.15,62.76 68.15,61.98 68.3,61.82 70.59,61.82 C2.-
  Bottom 0.254: v4.78,55.85 v6.35,55.85 | v25.86,10.64 28.14,10.64 v28.65,10.13 | X4.1 74.37,38.2 R20.1 | v40.46,17.92 39.84,17.9 v33.73,11.86 | v30.63,10.87 v31.88,11.86
  Bottom 0.305: 143.21,51.82 143.84,52.45 143.84,57.3 J1.2 | 143.21,51.82 142.95,51.56 142.95,50.98 C12.+ | TP7.TP 154.2,46.46 151.13,49.53 150.65,49.53 J11.2 145.47,49.56 143.21,51.82 | U$22.3 17.81,25.53 R21.2 19.05,24.18 15.7,20.83 15.7,19.66 16.05,19.3 17.5,19.3 | v17.88,50.14 v20.55,50.22
  Bottom 0.406: X6.1 64.97,42.39 | 64.97,42.39 C3.+ | v7.72,39.6 v17.22,39.6 v26.42,39.6 | 64.97,42.39 71.45,42.39 X4.1 | v43.18,61.39 v40.95,61.39 | v44.35,66.88 C26.+ | v66.95,6.58 RELAY.P$4 | J8.5 121.97,49.23 121.95,49.25
  Bottom 0.61: 121.95,49.25 113.16,58.04 104.39,58.04 | v99.54,62.89 104.39,58.04 | v80.37,62.89 79.78,63.07 71.98,63.07 C2.- | 104.39,58.04 104.39,57.56 v103.18,56.34
D+  (via drill 0.2)
  Top 0.203: U$2.57 42.48,20.26 v43.23,19.51 | v51.51,14.91 53.06,14.91 54.66,13.31 61.44,13.31 66.17,8.59 71.04,8.59 72.9,10.44 73.23,11.1 USB.P$3
  Bottom 0.203: v43.23,19.51 47.57,19.51 48.34,18.62 49.66,18.62 51.51,16.89 v51.51,14.91
D-  (via drill 0.2)
  Top 0.203: v41.91,19.2 42.09,19.23 42.06,21.46 U$2.56
  Bottom 0.203: v41.91,19.2 41.91,15.29 42.82,14.17 62.66,14.17 62.66,16.31 71.2,16.31 USB.P$2
IN_FLOATPWR
  Bottom 1.016: J4.1 20.85,5.38 22.83,3.4 37.67,3.4 RELAY.P$1
N$1
  Top 0.203: R1.2 57.91,50.83 R6.2
  Top 0.61: R1.2 59.77,53.47 IC1.3
N$2
  Top 0.254: IC1.1 61.42,62.48 63.12,64.19 66.75,64.19 R4.3
N$3
  Top 0.203: R7.2 119.84,65.25
  Top 0.406: J8.1 119.81,65.07 R7.2
N$4  (via drill 0.2)  (1 unrouted)
  Top 0.254: 16.33,53.49 16.33,55.07 v18.39,55.47 | v20.9,55.5 21.51,56.11 | 21.51,56.11 21.51,56.91 U$11.2 | J6.1 23.06,60.32 v24.59,58.8 | v24.59,56.62 23.62,55.65 21.97,55.65 21.51,56.11
  Top 0.305: R26.1 14.78,51.94 16.33,53.49
  Bottom 0.254: v18.39,55.47 v20.9,55.5 | v24.59,56.62 v24.59,58.8
N$5
  Top 0.254: R15.2 124.43,5.05 127.38,2.11 134.82,2.11 J9.4 140.34,8.15 143.43,11.25 146.46,11.25 R16.1 | R16.1 152.12,18.19 158.06,18.19 158.06,13.61 158.01,13.56 158.01,12.29 156.01,10.29 156.01,7.8 J9.8 | R16.1 150.67,16.92 148.54,19.05 148.54,21.18 145.64,24.08 145.64,25.7 U$1.P$8
N$6
  Bottom 0.203: R20.2 72.47,30.58 75.21,27.84 75.21,25.7 X6.5
N$7
  Top 0.254: 66.57,57.23 67.51,53.82 IC1.6 69.04,53.82 | R3.2 66.6,63.42 TP5.TP
  Top 0.406: 66.57,57.23 R3.2
  Top 0.61: 69.04,53.82 70.56,52.3 70.56,46.58 X4.3
N$8
  Top 0.254: R2.2 58.98,55.42
  Top 0.61: 58.98,55.42 IC1.2 61.8,56.36 63.73,57.4 R3.1
N$9
  Top 0.61: X4.2 71.83,49.5 75.9,53.57 R14.1
N$10
  Top 0.406: U$15.2 39.55,60.38 C1.+
N$11
  Top 0.254: 141.45,64.11 141.45,65.05 140.61,65.89 139.37,65.89 138.74,65.25 138.74,64.09 R10.1
  Top 0.305: 141.45,64.11 J1.1
N$12  (via drill 0.25)
  Top 0.406: J2.2 v81.89,44.27 83.62,42.85 85.52,42.85 87.05,44.37 87.05,51.38 89.48,53.82 U$4.5
  Bottom 0.203: v81.89,44.27 81.86,47.57 86.72,52.43 86.72,58.32 J3.2
N$15
  Top 0.254: R19.1 29.53,11.8 29.72,11.63 30.99,11.63 31.95,10.64 31.95,9.12 31.45,8.61 30.7,8.61 PWR1.A
N$16
  Top 0.203: U$9.4 6.19,63.11 J7.1
N$17
  Top 0.406: U$15.4 42.09,60.88 C1.-
N$18  (1 unrouted)
  Top 0.203: 10.87,53.82 12.9,55.85
  Top 0.254: 13.41,55.85 12.9,55.85 U$10.2
  Top 0.406: J5.1 15.37,63.22 15.37,62.89 15.34,57.51 13.41,55.85
N$20
  Top 0.254: U$4.1 97.99,49.86 R11.2
N$21
  Top 0.254: Q4.1 91.14,45.85 R11.1
N$22
  Top 0.406: U$18.2 47.4,65.4 48.39,66.4 50.52,66.4 51.54,67.41 51.54,68.38 C25.+
N$23
  Top 0.406: C10.- 44.86,56.29 U$18.5 44.86,60.68 45.49,61.32 51.31,61.32 52.65,62.66 53.16,62.66 53.72,63.22 U$16.3
N$25  (via drill 0.2)
  Top 0.406: U$18.4 44.86,65.86 v45.21,66.22 | v47.57,67.56 48.69,67.56 C25.-
  Bottom 0.406: v45.21,66.22 46.23,66.22 v47.57,67.56
N$26
  Top 0.406: U$16.2 54.99,67.26 C24.+
N$27
  Top 0.203: USB1.A 56.12,37.49 R27.1
N$28
  Top 0.406: U$16.4 52.45,66.75 C24.-
N$29  (via drill 0.2)
  Top 0.203: J2.1 84.53,45.44 | v103.81,45.8 105.64,45.8 106.02,46.18 106.02,47.29 C29.2
  Top 0.61: R14.2 82.4,49.61 v84.53,47.47 84.53,45.44 | C29.2 116.97,58.24 R7.1
  Bottom 0.203: v84.53,47.47 86.16,45.85 89,45.85 89.05,45.8 v103.81,45.8
N$30
  Top 0.254: C30.- 135.97,21.51 U$1.P$3 136.22,24.84 U$1.P$4
  Bottom 0.254: C31.1 126.85,22.81 128.3,21.36 128.3,17.3 C30.- | J9.3 136.37,21.36 U$1.P$3
N$33
  Top 0.406: U$15.5 43.55,69.2 C26.- 44.37,68.15 46.13,66.4 U$18.3
N$35  (via drill 0.6)
  Top 0.254: v68.61,60.58 68.61,62.41 v69.29,63.09
  Bottom 0.254: IC1.5 68.63,51.16 66.19,53.59 66.19,58.17 v68.61,60.58 | v69.29,63.09 69.29,63.75 71.35,65.81 73.46,65.81 R4.1
N$36
  Top 0.254: U$1.P$10 148.08,23.24 U$1.P$11
  Bottom 0.254: U$1.P$11 149.81,18.62 147.78,16.59 147.78,8.1 J9.6 148.26,9.83 C32.+ 154.2,22.58 C33.2
N$37
  Bottom 0.254: J9.1 128.45,10.13 131.24,12.93 131.24,19.94 U$1.P$1
N$38
  Top 0.254: C34.2 125.7,15.8 127.03,14.48 131.9,14.48 R16.2 138.91,21.49 U$1.P$7 143.03,21.51 U$1.P$5
N$39
  Top 0.254: R15.1 124.43,12.8 C34.1 123.54,12.95 123.29,14.02 123.32,18.14 128.75,18.24 128.75,24.69 R12.1 133.78,27.28 U$1.P$2
N$110
  Top 0.203: U$2.85 53.42,27.04 C8.A 54.44,27.34 C7.1
OSC1
  Top 0.203: U$2.63 44.88,17.79 Q1.1 43.08,16.23 42.01,16.23 41.65,16.6 C17.2
OSC2
  Top 0.203: U$2.64 45.28,19.06 45.82,18.26 46.78,18.26 | C18.2 Q1.3
  Top 0.254: Q1.3 46.78,18.26
PGC  (via drill 0.2)
  Top 0.203: U$2.26 36.86,33.07 36.86,33.35 v37.01,33.53 | v61.14,35.64 63.02,33.68 v88.09,33.68 | v91.67,30.18 v91.67,18.95 | v93.04,17.58 93.93,17.58 94.87,16.64 94.87,14.35 SV10.5
  Bottom 0.203: v37.01,33.53 39.12,35.64 v61.14,35.64 | v88.09,33.68 v91.67,30.18 | v91.67,18.95 v93.04,17.58
PGD  (via drill 0.2)
  Top 0.203: SV10.4 97.43,9.25 93.42,5.49 55.37,5.44 52.45,8.1 42.16,8.1 v35.13,15.19 | v35.15,21.67 34.95,21.64 34.95,24.43 36.07,25.37 36.07,26.95 35.74,27.3 35.74,29.11 v34.32,30.12 | v34.77,33.58 35.26,33.58 36.45,32.66 37.9,32.66 U$2.27
  Bottom 0.203: v35.13,15.19 v35.15,21.67 | v34.32,30.12 34.32,32.69 v34.77,33.58
RA0
  Top 0.203: 42.9,39.5 43.03,38.94 43.05,38.79 43.28,38.58 43.28,34.89 U$2.17
  Top 0.305: TP9.TP 41.78,40.61 42.9,39.5
RA2  (via drill 0.2)
  Top 0.203: U$24.7 36.63,35.3 v38.05,33.68 | v42.65,24.59 42.8,23.6 42.93,23.29 42.9,23.27 42.9,21.59 U$2.58
  Bottom 0.203: v38.05,33.68 38.05,29.39 40.44,27 41.94,27 42.7,26.03 42.67,24.94 v42.65,24.59
RA3  (via drill 0.2)
  Top 0.203: U$24.6 35.58,34.65 v36.07,34.16 | v41.66,26.06 42.09,26.03 v43.23,26.59 | v43.54,24.28 43.54,24.05 43.28,23.8 U$2.59
  Bottom 0.203: v36.07,34.16 36.07,32.74 36.42,32.38 36.42,32.26 37.44,31.24 37.44,30.15 37.59,30 37.59,27.94 38.89,26.64 40.97,26.64 v41.66,26.06 | v43.23,26.59 43.26,26.24 43.26,24.56 v43.54,24.28
RB0  (via drill 0.2)
  Top 0.203: U$9.2 5.54,53.14 R24.2 2.64,50.24 2.64,39.47 v3.38,38.73 | U$2.25 39.83,36.42 v37.52,38.73
  Bottom 0.203: v3.38,38.73 v37.52,38.73
RB1  (via drill 0.5)
  Top 0.254: U$2.24 40.48,33.79 40.79,33.48 40.79,33.43 v48.72,25.98 | v55.45,23.72 55.63,23.65 v57.35,22.1 | v62.13,20.93 62.59,20.93 63.42,20.78
  Top 0.305: v72.34,20.7 64.29,20.83 63.42,20.78 63.32,20.9
  Bottom 0.254: v48.72,25.98 48.82,25.4 50.57,23.62 55.45,23.62 v55.45,23.72 | v57.35,22.1 61.32,21.89 v62.13,20.93
  Bottom 0.305: 103.07,23.32 105.33,21.06 72.72,20.65 v72.34,20.7
RB2  (via drill 0.2)
  Top 0.203: SV10.6 92.35,22 93.22,22.86 101.02,22.86 v101.83,23.67 | v101.83,37.06 101.8,37.16 101.07,38.02 79.2,38 77.27,40.34 65,40.34 63.12,42.21 61.11,42.21 57.99,45.34 v47.73,45.31 | 41,38.51 v40.97,38.51 40.89,38.46 40.89,34.93 U$2.23
  Bottom 0.203: v101.83,37.06 v101.83,23.67 | v40.97,38.51 v47.73,45.31
RB8  (via drill 0.2, 0.6)  (1 unrouted)
  Top 0.203: R13.2 33.86,31.17 34.39,30.86 35.18,30.43 36.04,30.12 36.6,30.12 37.03,30.66 37.92,30.68 | v32.89,29.41 R13.2 | 30.76,35.3 30.89,35.18 v31.12,35.18 | v32.82,32.49 32.82,31.37 R13.2
  Top 0.305: 22,28.27 v21.95,28.27 22.07,28.14 22.07,23.67 20.04,21.64 R21.1 17.42,19.91 C11.2 | 22,28.27 22.02,28.27 22.07,28.32 22.05,28.32 22,28.27 | U$24.2 30.99,35.3 v31.12,35.18
  Bottom 0.203: v32.89,29.41 27.89,28.24 v21.95,28.27 | v31.12,35.18 31.5,34.8 31.5,33.6 v32.82,32.49
RB15  (via drill 0.2)
  Top 0.203: v77.67,22.91 X6.6 | v40.41,25.88 38.02,25.88 U$2.44
  Bottom 0.203: 70.49,22.94 43.13,22.94 v40.41,25.88 | 70.49,22.94 70.49,22.91 | 70.49,22.94 70.49,23.6 72.01,23.6 72.01,22.91 v77.67,22.91
RC1  (via drill 0.2)
  Top 0.203: v93.75,36.14 93.73,36.14 93.4,36.19 65.46,36.19 57.2,44.45 49.4,44.45 47.7,41.86 47.7,34.91 U$2.6 | v93.75,38.66 93.73,42.16 Q4.2
  Bottom 0.203: v93.75,36.14 v93.75,38.66
RC13  (via drill 0.2)
  Top 0.203: C20.1 59.6,21.38 53.7,21.39 52.25,21.39 Q3.X1 52.17,20.47 v51.54,19.84 | v48.39,19.81 48.29,19.94 48.36,20.04 48.9,20.32 48.9,21.46 U$2.73
  Bottom 0.203: v48.39,19.81 v51.54,19.84
RC14  (via drill 0.2)
  Top 0.203: C19.1 53.62,17.75 52.6,18.77 Q3.X2 50.9,18.77 v50.37,19.2 | v48.84,19.2 49.3,19.23 49.3,21.4 U$2.74
  Bottom 0.203: v48.84,19.2 v50.37,19.2
RD1  (via drill 0.2)
  Top 0.203: 5.03,41.38 5.03,38.4 v6.88,36.6 | v33.73,36.63 35.2,36.65 | 35.2,36.65 35.26,36.65 | 35.2,36.65 36.02,36.25 35.99,36.25 36.07,36.17 36.25,35.97 36.47,36.17 48.87,23.52 51.25,23.47 U$2.76
  Top 0.406: R5.2 5.03,41.38 X1.1
  Bottom 0.203: v6.88,36.6 v33.73,36.63
RD2  (via drill 0.2)
  Top 0.203: U$2.77 49.18,23.9 36.02,37.16 35.43,37.29 v35,37.31 | v15.75,37.26 14.28,38.76 R17.2 | R17.2
  Top 0.406: X2.1 14.28,46.46 R17.2
  Bottom 0.203: v15.75,37.26 v35,37.31
RD3  (via drill 0.2)
  Top 0.203: R18.2 23.93,39.52 v25.53,37.92 | v33.4,37.92 35.48,37.92 36.3,37.41 49.35,24.26 51.24,24.28 U$2.78
  Top 0.406: X3.1 23.93,46.46 R18.2
  Bottom 0.203: v25.53,37.92 33.4,37.95 v33.4,37.92
RD4
  Top 0.203: X6.8 82.75,21.77 82.58,21.59 63.32,21.59 59.89,25.02 52.88,25.02 52.38,25.48 51.26,25.48 U$2.81
RD5
  Top 0.203: X6.7 80.21,22.71 79.63,22.12 63.32,22.12 60.05,25.4 53.16,25.4 52.68,25.86 51.29,25.86 U$2.82
RE0
  Top 0.203: X8.1 85.29,29.03 84.38,29.95 76.4,29.95 76.23,30.2 51.32,30.28 U$2.93
RE1
  Top 0.203: X8.2 87.83,28.4 85.6,30.63 53.47,30.73 53.14,30.71 51.24,30.66 U$2.94
RE2
  Top 0.203: X8.3 90.37,29.34 87.55,32.23 51.29,32.26 U$2.98
RE3
  Top 0.203: X8.4 92.91,30.96 92.28,32.61 52.22,32.66 U$2.99
RE4
  Top 0.203: X8.5 95.45,31.57 93.88,33.05 51.43,33.05 U$2.100
RE5
  Top 0.203: X8.6 97.99,33.83 97.54,34.29 65.02,34.29 56.29,43.03 49.86,43.03 48.87,41.33 48.87,34.91 U$2.3
RE6
  Top 0.203: X8.7 100.53,34.01 99.77,34.77 65.23,34.77 56.59,43.41 49.66,43.41 48.46,41.48 48.46,34.9 U$2.4
RE7  (via drill 0.6)
  Top 0.305: v115.14,38.02 109.93,38.02 108.89,36.98 108.41,36.98 R8.2
  Bottom 0.305: X8.8 103.07,23.19 105.28,20.98 106.73,20.98 117.4,31.65 117.4,35.76 v115.14,38.02
RE8  (via drill 0.2)
  Top 0.203: 36.02,44.09 40.41,39.7 41.3,39.7 42.29,38.71 42.29,37.87 42.88,37.29 U$2.18
  Top 0.254: U$11.4 22.39,58.84 23.62,57.61 26.8,57.61 v30.28,54.13 | v30.28,51.33 36.02,45.59 36.02,44.09
  Bottom 0.254: v30.28,54.13 v30.28,51.33
RE9  (via drill 0.2)
  Top 0.203: U$10.4 14.23,59.34 v14.25,59.36 | v23.01,53.09 25.1,50.93 v25.93,50.93 | v42.14,36.7 42.44,36.02 42.47,35.89 42.47,34.96 U$2.19
  Bottom 0.203: v14.25,59.36 15.27,59.36 17.63,57 17.63,53.75 18.29,53.09 v23.01,53.09 | v25.93,50.93 28.22,49.3 28.22,46.91 33.76,41.17 36.73,41.17 v42.14,36.7
RG15
  Top 0.203: U$2.1 50.17,34.89 USB1.C
USBID
  Top 0.203: U$2.51 38.79,21.08 R9.1
V+  (via drill 0.2, 0.5)
  Top 0.203: R13.1 29.59,31.34
  Top 0.254: v27.31,31.14 29.79,31.14 R13.1 | C4.1 4.57,31.24 5.89,32.56 8.48,32.56 10.82,30.23 13.69,30.23 U$22.4
  Top 0.305: 31.01,21.26 31.01,22.17 32.56,23.72 32.56,26.21 29.59,29.18 29.87,30.61 R13.1 | 29.59,31.34 29.59,32.11 27.38,34.32 27.38,38.51 28.58,39.7 31.04,39.7 34.85,43.51 34.85,45.67 34.57,45.95 33.99,45.95 29.18,50.75 29.18,52.48 40.77,52.48 41.02,52.22 41.02,50.65 45.75,45.92 47.3,45.92 48.82,47.45 48.82,50.29 48.64,50.47 48.64,54.16 C27.1
  Top 0.406: C27.1 55.07,55.63 R2.1
  Top 0.61: RELAY.P$2 46.28,3.45 43.43,6.43 41.02,6.43 36.47,11 36.12,10.95 v33.15,13.92 | 31.01,21.26 v30.91,21.16
  Bottom 0.254: 14.78,30.61 26.77,30.61 v27.31,31.14
  Bottom 0.305: J10.1 6.93,20.73 14.02,27.81 14.02,30.56 U$22.4 14.78,30.61
  Bottom 0.61: v33.15,13.92 33.15,15.24 30.91,17.48 v30.91,21.16
V-  (via drill 0.2, 0.6)
  Top 0.406: TP6.TP 11.81,34.26 14.78,34.26 17.27,36.75 17.27,37.77 19.58,40.08 19.58,40.82 v20.35,41.58 | v30.07,41.96 30.63,41.96 v33.58,44.91 | v46.84,48.56 46.84,50.85 C28.2 47.27,50.9 v47.32,50.95 | v53.29,53.09 54.99,53.09 R1.1 | v79.96,42.77 67.69,42.77 v61.9,48.56 | 123.27,53.31 123.39,53.19 J8.4 129.13,53.19 129.24,53.09 129.29,53.09 | 129.29,53.09 129.36,53.16 | 129.29,53.09 129.46,53.09 129.49,53.06
  Top 0.61: 123.27,53.31 122.02,52.07 115.8,52.07 v108.15,44.42 | J4.2 14.17,9.6 12.7,11.07 3.66,11.07 1.55,13.18 1.55,32.69 3.18,34.32 11.76,34.32 11.81,34.26
  Bottom 0.406: v20.35,41.58 29.69,41.58 v30.07,41.96 | v33.58,44.91 38.1,44.91 39.04,45.85 44.12,45.85 v46.84,48.56 | v47.32,50.95 51.16,50.95 v53.29,53.09 55.37,51 58.95,51 61.39,48.56 v61.9,48.56 | v108.15,44.42 89.21,44.42 87.63,42.85 80.04,42.85 v79.96,42.77
VBUS  (via drill 0.2)
  Top 0.203: v36.45,15.9 37.14,16.59 37.69,16.59 40.46,19.35 40.49,19.35 41.28,20.14 U$2.54
  Bottom 0.203: 75.67,14.81 USB.P$1 | C13.+ 85.85,8.84 | 32.87,12.85 33.2,12.85
  Bottom 0.305: X7.1 24.99,21.62 25.71,20.9
  Bottom 0.406: 75.67,14.81 76.96,16.1 80.14,16.1 85.85,13.74 85.85,8.84 | 25.71,20.9 25.81,20.9 28.37,20.9 29.06,20.22 29.06,16.33 32.87,12.85 32.87,10.9 35.81,7.62 70.33,7.62 72.16,3.89 74.5,3.89 74.98,3.91 76.68,3.91 82.42,8.31 84.23,8.84 C13.+ | 33.2,12.85 33.43,12.62 33.76,12.62 36.45,15.32 v36.45,15.9
VOL_SENSE_GND
  Bottom 0.61: 8.61,1.57 112.9,1.57 118.26,6.93 118.26,26.52 J8.8
  Bottom 1.016: J4.4 6.25,3.2 7.87,1.65 8.46,1.42 8.61,1.57
VOL_SENSE_POS
  Bottom 0.61: J4.3 10.21,15.24 U$22.1
VPP  (via drill 0.2)
  Top 0.203: R23.1 105.44,13.94 SV10.1 105.05,21.97 105.64,22.76 105.69,22.76 v105.16,23.29 | v105.16,32.33 100.2,36.73 78.21,36.73 76.56,38.94 v64.21,38.91 | U$2.13 v44.86,38.4
  Bottom 0.203: v105.16,32.33 v105.16,23.29 | v64.21,38.91 63.35,40 63.35,41.02 62.38,41.02 46.61,40.92 v44.86,38.4
VREF  (via drill 0.2, 0.5)
  Top 0.203: v33.71,32.36 34.16,32.38 34.52,32.13 35,32.13 35.05,32.08 35.74,32.08 35.97,31.85 38.16,31.85 U$2.29
  Top 0.254: v25.22,31.45 25.22,32.67 U$8.1 25.46,34.1 24.47,35.09 | 24.47,35.09 23.55,36.02 22.12,36.02 R22.2 | v28.17,35.33 28.21,35.88 U$24.1 v30.77,35.95 v30.79,35.94 | v25.88,35.84 25.32,35.94 24.47,35.09
  Bottom 0.203: v30.79,35.94 31.37,35.94 31.9,35.41 31.9,33.99 32.72,33.17 33.02,33.17 v33.71,32.36
  Bottom 0.254: TP8.TP 18.06,33.96 20.93,31.09 24.87,31.09 v25.22,31.45 | v25.88,35.84 v28.17,35.33

### Text on the board
tPlace: GND | GND | GND
tNames: Pin 1 | 1 | 1 | 1 | -28v | -28v | 1 | 1 | +5v | +5v | V- | PST Board - Version 10.xx | Quantum Focus Instruments | V+ | Load | Sense_GND | Sense_Positive | V- | V+ | 1 | Power Input